# EAGLE design sternkoppler_4fach (EAGLE 8.5.1)
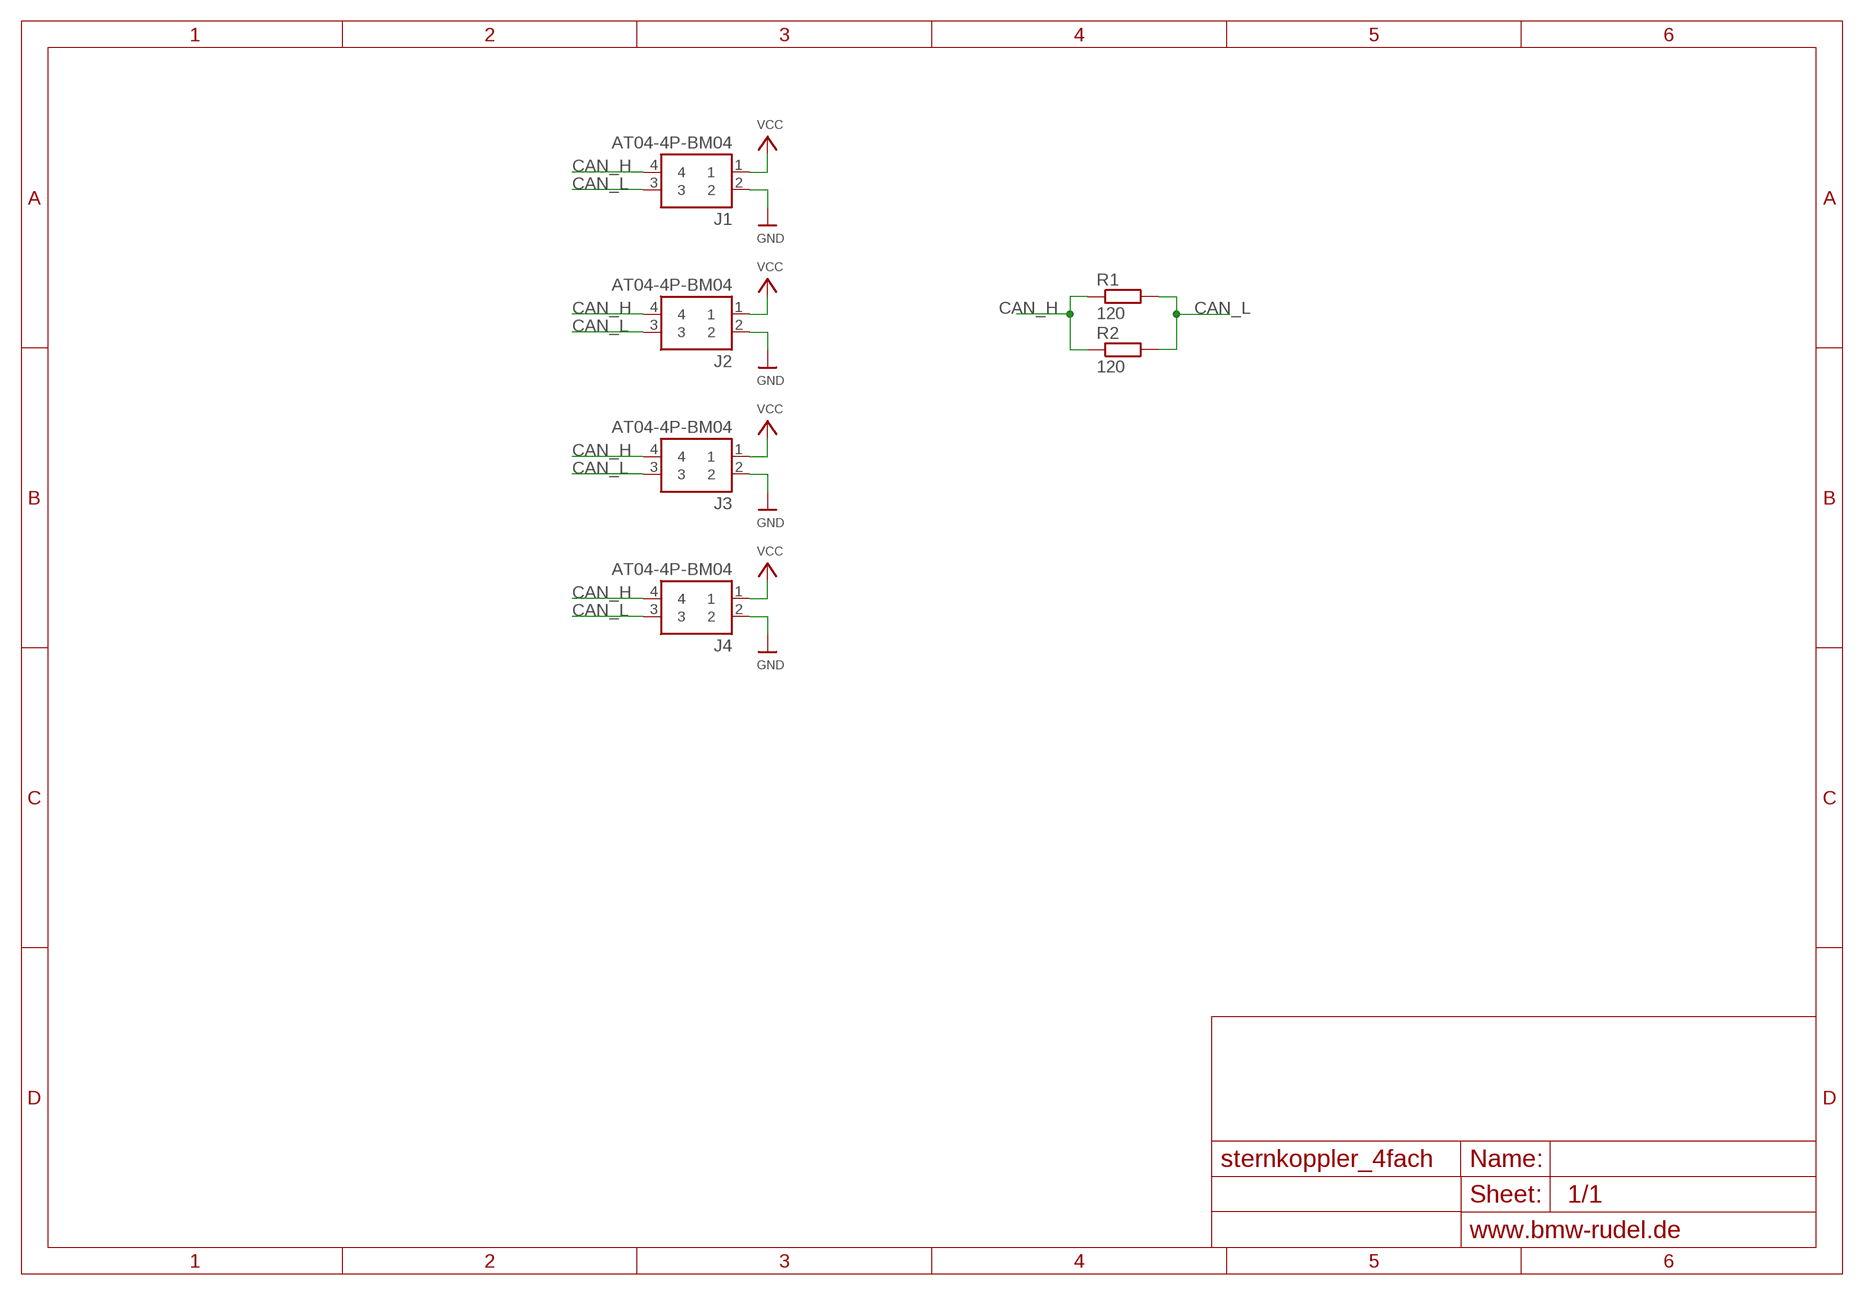
[diagram p0: schematic, sheet 1]

## Parts
J1  AT04-4P-BM04  [AT044PBM04]
J2  AT04-4P-BM04  [AT044PBM04]
J3  AT04-4P-BM04  [AT044PBM04]
J4  AT04-4P-BM04  [AT044PBM04]
R1  120  R-EU_R0805  [R0805]
R2  120  R-EU_R0805  [R0805]

## Nets
CAN_H: J1.4 J2.4 J3.4 J4.4 R1.1 R2.1
CAN_L: J1.3 J2.3 J3.3 J4.3 R1.2 R2.2
GND: J1.2 J2.2 J3.2 J4.2
VCC: J1.1 J2.1 J3.1 J4.1

## Library data of the parts
J1-J4 = Heinrich:AT04-4P-BM04: AMPHENOL SINE/TUCHEL - AT04-4P-BM04 - RECTANGULAR CONN, RCPT, 4POS, PCB, BLK Source: Datasheet <http://www.amphenol-sine.com/pdf/datasheet/AT04-4P-BM04.pdf>; ARROW_PART_NUMBER: AT04-4P-BM04; ARROW_PRICE-STOCK: https://www.arrow.com/en/products/at04-4p-bm04/amphenol-sine-systems?region=europe; DESCRIPTION: AMPHENOL SINE/TUCHEL - AT04-4P-BM04 - RECTANGULAR CONN, RCPT, 4POS, PCB, BLK; HEIGHT: 23.4mm; MANUFACTURER_NAME: Amphenol; MANUFACTURER_PART_NUMBER: AT04-4P-BM04; MOUSER_PART_NUMBER: 654-AT04-4P-BM04; MOUSER_PRICE-STOCK: https://www.mouser.co.uk/ProductDetail/Amphenol-SINE-Systems/AT04-4P-BM04?qs=lhkzy8lC%252BStoqNNCv02BhQ%3D%3D
R1 R2 = rcl:R-EU_: RESISTOR, European symbol; SPICEPREFIX: R

## Board
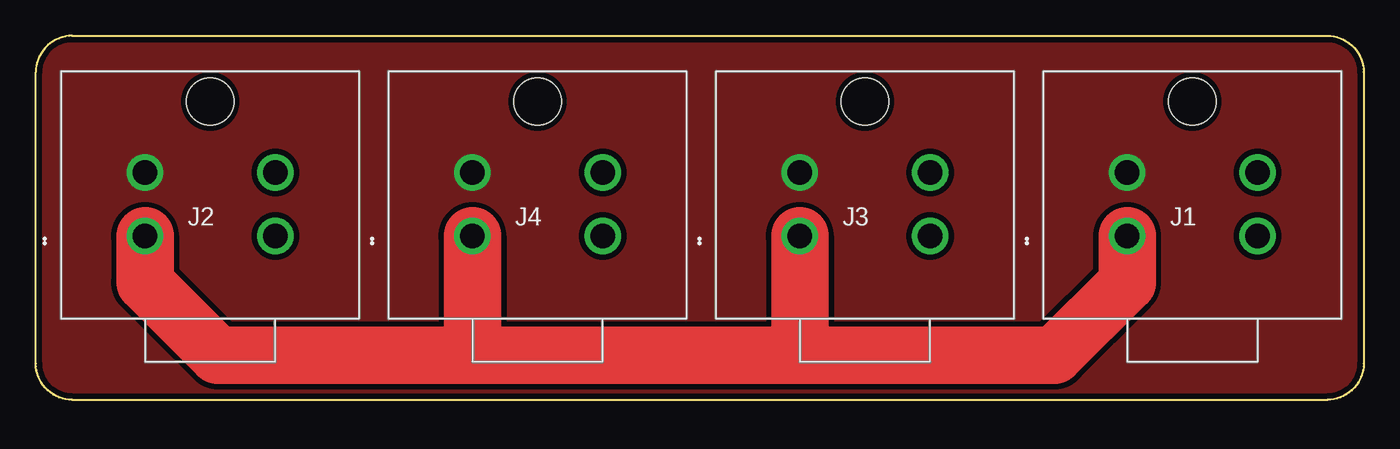
[diagram p1: board, top side]
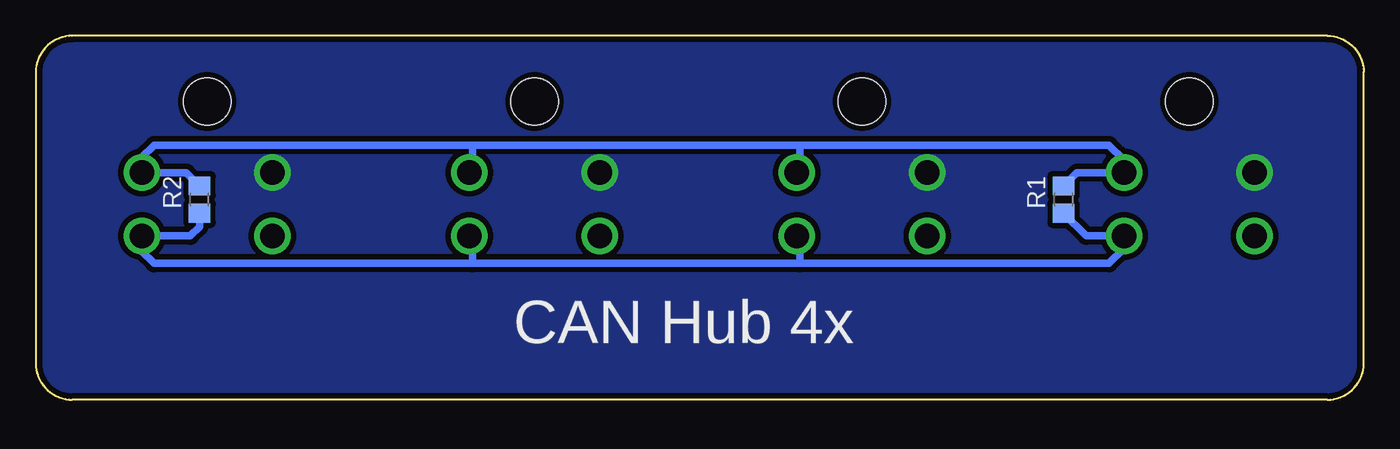
[diagram p2: board, bottom side, seen from below]

Size 92.71 x 25.4 mm. Coordinates in mm from the lower left corner, seen from the top.
Outline: 2.54,0 arc-90 0,2.54 0,22.86 arc-90 2.54,25.4 90.17,25.4 arc-90 92.71,22.86 92.71,2.54 arc-90 90.17,0 2.54,0
Copper layers (1*16): Top 0.035mm / dielectric 1.5mm / Bottom 0.035mm
Design rules "aisler_2_layer": minimum track width 0.1mm, minimum drill 0.2mm, track to track 0.1mm, track to pad 0.1mm, pad to pad 0.1mm, via to via 0.1mm, smd to smd 0.1mm, copper to edge 0.2mm, drill to drill 0.21mm, minimum pad ring 0.25mm, minimum via ring 0.15mm, stop-mask expansion 0mil, vias tented up to drill 0mil, thermal gap 10mil

### Footprints (pad centres in the part's own frame; a part is rotated, then mirrored left to right if it is on the bottom)
AT044PBM04 = drill 1.7 pad 2.55: 1 0,0; 2 0,4.42; 3 9.1,4.42; 4 9.1,0 | hole 3.3: 4.55,9.39
R0805 = smd 1.3 x 1.5: 1 -0.95,0; 2 0.95,0

### Placement (x,y rotation side)
J1  76.2,11.43 0 top
J2  7.62,11.43 0 top
J3  53.34,11.43 0 top
J4  30.48,11.43 0 top
R1  20.95,13.97 90 bottom
R2  81.28,13.97 90 bottom

### Tracks (layer width: path | path; a pad name or v marks a point on that pad's centre or on a via)
CAN_H
  Bottom 0.508: 39.37,9.53 17.78,9.53 16.72,10.59 J2.4 19.36,11.43 R1.1 | 39.37,9.53 62.23,9.53 | 62.23,9.53 84.45,9.53 85.3,10.37 J1.4 81.92,11.43 81.28,12.06 R2.1 | 39.37,9.53 39.37,11.22 J4.4 | 62.23,9.53 62.23,11.22 J3.4
CAN_L
  Bottom 0.508: 39.37,17.78 17.78,17.78 16.72,16.72 J2.3 20.02,15.85 R1.2 | 39.37,17.78 62.23,17.78 | 62.23,17.78 84.45,17.78 85.3,16.93 J1.3 82.21,15.85 R2.2 | 62.23,17.78 62.23,16.06 J3.3 | 39.37,17.78 39.37,16.06 J4.3
GND
  pour Top (isolate 0.381, no thermals): -1.27,27.94 95.25,27.94 95.25,-2.54 -1.27,-2.54
  pour Bottom (isolate 0.381, no thermals): -5.08,29.21 101.6,29.21 101.6,-5.08 -5.08,-5.08
VCC
  Top 4: J1.1 76.2,8.17 71.12,3.09 53.34,3.09 | J2.1 7.62,8.17 12.7,3.09 30.48,3.09 | 30.48,3.09 53.34,3.09 | J4.1 30.48,3.09 | J3.1 53.34,3.09

### Text on the board
bNames: CAN Hub 4x